# Altium project OvertheTOP.PrjPcb
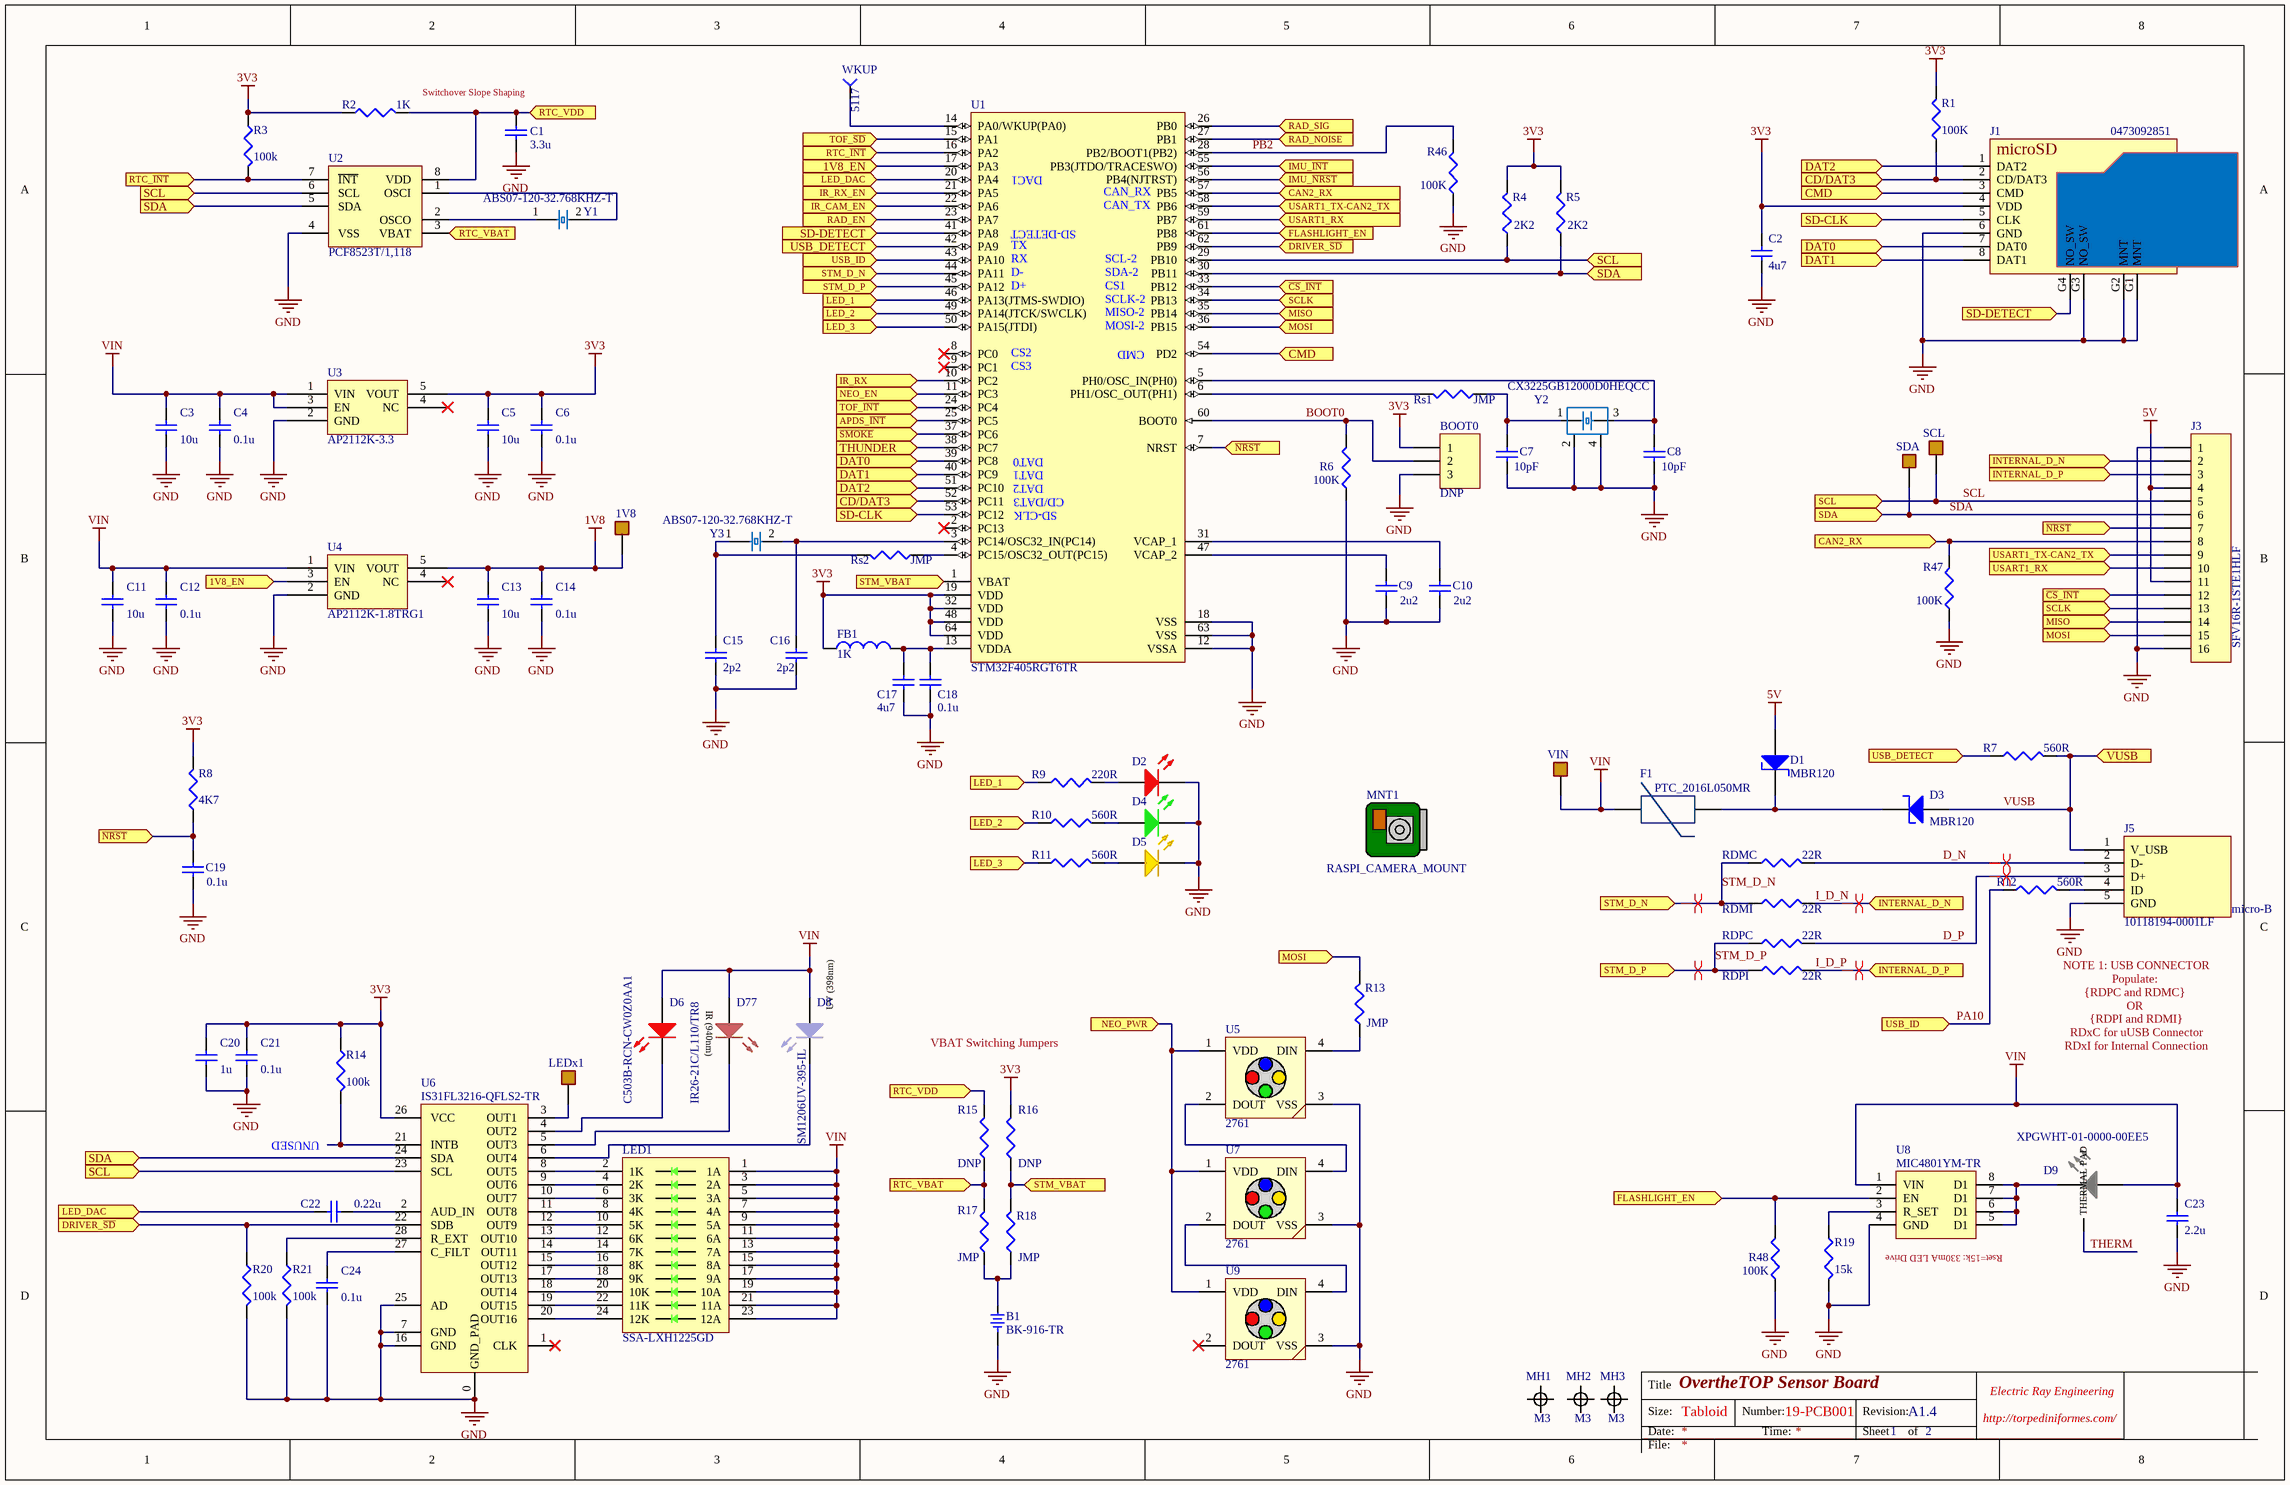
[diagram p0: OvertheTOP_Logistics.SchDoc]
1 sheet, 93 parts. Net scope: global (net labels, ports and power ports of the same name join across sheets).

## Sheet OvertheTOP_Logistics.SchDoc: OvertheTOP Sensor Board
size Tabloid; CompanyName: afasfe; Organization: Electric Ray Engineering; Address1: asdf; Address2: http://torpediniformes.com/; Address3: asdf; Address4: asdf; DocumentNumber: 19-PCB001; Revision: A1.4; SheetNumber: 1; SheetTotal: 2

### Parts
1V8  1.5mm  [TP_1.5mm_Square_Bare]  (value not drawn)
B1  BK-916-TR  [BK-916-TR]
BOOT0  value DNP  [HDR1X3]  (hidden comment: Header 3)
C1  value 3.3u  [6-0805_L]  (hidden comment: Cap)
C2  value 4u7  [1608[0603]]  (hidden comment: Cap Semi)
C3  value 10u  [6-0805_L]  (hidden comment: Cap)
C4  value 0.1u  [6-0805_L]  (hidden comment: Cap)
C5  value 10u  [6-0805_L]  (hidden comment: Cap)
C6  value 0.1u  [6-0805_L]  (hidden comment: Cap)
C7  value 10pF  [1608[0603]]  (hidden comment: Cap Semi)
C8  value 10pF  [1608[0603]]  (hidden comment: Cap Semi)
C9  value 2u2  [1608[0603]]  (hidden comment: Cap Semi)
C10  value 2u2  [1608[0603]]  (hidden comment: Cap Semi)
C11  value 10u  [6-0805_L]  (hidden comment: Cap)
C12  value 0.1u  [6-0805_L]  (hidden comment: Cap)
C13  value 10u  [6-0805_L]  (hidden comment: Cap)
C14  value 0.1u  [6-0805_L]  (hidden comment: Cap)
C15  value 2p2  [1608[0603]]  (hidden comment: Cap Semi)
C16  value 2p2  [1608[0603]]  (hidden comment: Cap Semi)
C17  value 4u7  [1608[0603]]  (hidden comment: Cap Semi)
C18  value 0.1u  [1608[0603]]  (hidden comment: Cap Semi)
C19  value 0.1u  [1608[0603]]  (hidden comment: Cap Semi)
C20  value 1u  [6-0805_L]  (hidden comment: Cap)
C21  value 0.1u  [6-0805_L]  (hidden comment: Cap)
C22  value 0.22u  [6-0805_L]  (hidden comment: Cap)
C23  value 2.2u  [6-0805_L]  (hidden comment: Cap)
C24  value 0.1u  [6-0805_L]  (hidden comment: Cap)
D1  Diode  [SOD-123FL]  (value not drawn)
D2  LED_RED_SMD  [IN-S63AT_RED]  (value not drawn)
D3  Diode  [SOD-123FL]  (value not drawn)
D4  LED_GREEN_0603  [IN-S63AT_GRN]  (value not drawn)
D5  LED_ORANGE_0603  [LO Q976]  (value not drawn)
D6  C503B-RCN-CW0Z0AA1  [C503B-RCN]
D8  SM1206UV-395-IL  [SM1206UV-395-IL]
D9  XPGWHT-01-0000-00EE5  [XP-G_LED]
D77  IR26-21C/L110/TR8  [IR26-21C/L110/TR8]
F1  PTC_2016L050MR  [PolyFuse_2016L]
FB1  value 1K  [J1-0603]  (hidden comment: Inductor)
J1  0473092851  [0473092851]
J3  SFV16R-1STE1HLF  [SFV16R-1STE1HLF]
J5  10118194-0001LF  [USB-R/A-10118194-0001LF]
LED1  SSA-LXH1225GD  [SSA-LXH1226GD]
LEDx1  1.5mm  [TP_1.5mm_Square_Bare]  (value not drawn)
MH1  M3  [M3_Loose]
MH2  M3  [M3_Loose]
MH3  M3  [M3_Loose]
MNT1  RASPI_CAMERA_MOUNT  [RPI-CAM-V2_1]
R1  value 100K  [J1-0603]  (hidden comment: Res3)
R2  value 1K  [J1-0603]  (hidden comment: Res3)
R3  value 100k  [J1-0603]  (hidden comment: Res3)
R4  value 2K2  [J1-0603]  (hidden comment: Res3)
R5  value 2K2  [J1-0603]  (hidden comment: Res3)
R6  value 100K  [J1-0603]  (hidden comment: Res3)
R7  value 560R  [J1-0603]  (hidden comment: Res3)
R8  value 4K7  [J1-0603]  (hidden comment: Res3)
R9  value 220R  [J1-0603]  (hidden comment: Res3)
R10  value 560R  [J1-0603]  (hidden comment: Res3)
R11  value 560R  [J1-0603]  (hidden comment: Res3)
R12  value 560R  [J1-0603]  (hidden comment: Res3)
R13  value JMP  [J1-0603]  (hidden comment: Res3)
R14  value 100k  [J1-0603]  (hidden comment: Res3)
R15  value DNP  [J1-0603]  (hidden comment: Res3)
R16  value DNP  [J1-0603]  (hidden comment: Res3)
R17  value JMP  [J1-0603]  (hidden comment: Res3)
R18  value JMP  [J1-0603]  (hidden comment: Res3)
R19  value 15k  [J1-0603]  (hidden comment: Res3)
R20  value 100k  [J1-0603]  (hidden comment: Res3)
R21  value 100k  [J1-0603]  (hidden comment: Res3)
R46  value 100K  [J1-0603]  (hidden comment: Res3)
R47  value 100K  [J1-0603]  (hidden comment: Res3)
R48  value 100K  [J1-0603]  (hidden comment: Res3)
RDMC  value 22R  [J1-0603]  (hidden comment: Res3)
RDMI  value 22R  [J1-0603]  (hidden comment: Res3)
RDPC  value 22R  [J1-0603]  (hidden comment: Res3)
RDPI  value 22R  [J1-0603]  (hidden comment: Res3)
Rs1  value JMP  [J1-0603]  (hidden comment: Res3)
Rs2  value JMP  [J1-0603]  (hidden comment: Res3)
SCL  1.5mm  [TP_1.5mm_Square_Bare]  (value not drawn)
SDA  1.5mm  [TP_1.5mm_Square_Bare]  (value not drawn)
U1  STM32F405RGT6TR  [STM-LQFP64_N]
U2  PCF8523T/1,118  [SO8_PCF8523]
U3  AP2112K-3.3  [SOT25]
U4  AP2112K-1.8TRG1  [SOT25]
U5  2761  [5050_SK6812]
U6  IS31FL3216-QFLS2-TR  [QFN28_ISSI]
U7  2761  [5050_SK6812]
U8  MIC4801YM-TR  [SOIC8_MIC4801]
U9  2761  [5050_SK6812]
VIN  1.5mm  [TP_1.5mm_Square_Bare]  (value not drawn)
WKUP  Manufacturer Part Number: 5117  [BLU_TP_KEYSTONE]  (hidden comment: BLU_TESTPOINT)
Y1  ABS07-120-32.768KHZ-T  [XTAL_32x15_BSB]
Y2  CX3225GB12000D0HEQCC  [XTAL32x25_BSB]
Y3  ABS07-120-32.768KHZ-T  [XTAL_32x15_BSB]

### Ports
1V8_EN, APDS_~{INT}, CAN2_RX, CD/DAT3, CMD, DAT0, DAT1, DAT2, DRIVER_~{SD}, FLASHLIGHT_EN, IMU_~{INT}, IMU_~{NRST}, INTERNAL_D_N, INTERNAL_D_P, IR_CAM_EN, IR_RX, IR_RX_EN, LED_1, LED_2, LED_3, LED_DAC, MISO, MOSI, NEO_EN, NEO_PWR, RAD_EN, RAD_NOISE, RAD_SIG, RTC_VBAT, RTC_VDD, RTC_~{INT}, SCL, SCLK, SD-CLK, SD-DETECT, SDA, STM_D_N, STM_D_P, STM_VBAT, THUNDER, TOF_~{INT}, TOF_~{SD}, USART1_RX, USART1_TX-CAN2_TX, USB_DETECT, USB_ID, VUSB, ~{CS}_~{INT}, ~{NRST}, ~{SMOKE}

### Nets
1V8: 1V8.1 C13.2 C14.2 U4.5(VOUT)
3V3: BOOT0.1 C2.2 C5.2 C6.2 C20.2 C21.2 FB1.1 J1.4(VDD) R1.2 R2.1 R3.1 R4.2 R5.2 R8.2 R14.1 R16.2 U1.19(VDD) U1.32(VDD) U1.48(VDD) U1.64(VDD) U3.5(VOUT) U6.26(VCC)
5V: D1.A J3.4 J3.11
GND: B1.2 BOOT0.3 C1.1 C2.1 C3.1 C4.1 C5.1 C6.1 C7.1 C8.1 C9.1 C10.1 C11.1 C12.1 C13.1 C14.1 C15.1 C16.1 C17.1 C18.1 C19.1 C20.1 C21.1 C23.1 C24.1 D2.K D4.K D5.K J1.6(GND) J1.G1(MNT) J1.G2(MNT) J1.G3(NO_SW) J3.1 J3.16 J5.5(GND) R6.1 R19.2 R20.2 R21.2 R46.1 R47.1 R48.1 U1.12(VSSA) U1.18(VSS) U1.63(VSS) U2.4(VSS) U3.2(GND) U4.2(GND) U5.3(VSS) U6.0(GND_PAD) U6.7(GND) U6.16(GND) U6.25(AD) U7.3(VSS) U8.4(GND) U9.3(VSS) Y2.2 Y2.4
VIN: C3.2 C4.2 C11.2 C12.2 C23.2 D6.1(A) D8.1(A) D9.1(A) D77.2 F1.2 LED1.1(1A) LED1.3(2A) LED1.5(3A) LED1.7(4A) LED1.9(5A) LED1.11(6A) LED1.13(7A) LED1.15(8A) LED1.17(9A) LED1.19(10A) LED1.21(11A) LED1.23(12A) U3.1(VIN) U3.3(EN) U4.1(VIN) U8.1(VIN) VIN.1
BOOT0: BOOT0.2 R6.2 U1.60(BOOT0)
D_N: J5.2(D-) RDMC.1
D_P: J5.3(D+) RDPC.1
I_D_N: J3.2 RDMI.1 ; port INTERNAL_D_N
I_D_P: J3.3 RDPI.1 ; port INTERNAL_D_P
PA10: R12.2 U1.43(PA10) ; port USB_ID
PB2: R46.2 U1.28(PB2/BOOT1(PB2))
SCL: J3.5 R4.1 SCL.1 U1.29(PB10) U2.6(SCL) U6.23(SCL) ; port SCL
SDA: J3.6 R5.1 SDA.1 U1.30(PB11) U2.5(SDA) U6.24(SDA) ; port SDA
STM_D_N: RDMC.2 RDMI.2 U1.44(PA11) ; port STM_D_N
STM_D_P: RDPC.2 RDPI.2 U1.45(PA12) ; port STM_D_P
THERM: D9.3(THERMAL_PAD)
VUSB: D3.A J5.1(V_USB) R7.1 ; port VUSB
NetB1_1: B1.1 R17.1 R18.1
NetC1_2: C1.2 R2.2 R15.2 U2.8(VDD) ; port RTC_VDD
NetC7_2: C7.2 Rs1.1 Y2.1
NetC8_2: C8.2 U1.5(PH0/OSC_IN(PH0)) Y2.3
NetC9_2: C9.2 U1.47(VCAP_2)
NetC10_2: C10.2 U1.31(VCAP_1)
NetC15_2: C15.2 Rs2.2 Y3.1
NetC16_2: C16.2 U1.3(PC14/OSC32_IN(PC14)) Y3.2
NetC17_2: C17.2 C18.2 FB1.2 U1.13(VDDA)
NetC19_2: C19.2 J3.7 R8.1 U1.7(NRST) ; port ~{NRST}
NetC22_1: C22.1 U1.20(PA4) ; port LED_DAC
NetC22_2: C22.2 U6.2(AUD_IN)
NetC24_2: C24.2 U6.27(C_FILT)
NetD1_K: D1.K D3.K F1.1
NetD2_A: D2.A R9.2
NetD4_A: D4.A R10.2
NetD5_A: D5.A R11.2
NetD6_2: D6.2(K) U6.4(OUT2)
NetD8_2: D8.2(K) U6.6(OUT4)
NetD9_2: D9.2(K) U8.5(D1) U8.6(D1) U8.7(D1) U8.8(D1)
NetD77_1: D77.1 U6.5(OUT3)
NetJ1_1: J1.1(DAT2) U1.51(PC10) ; port DAT2
NetJ1_2: J1.2(CD/DAT3) R1.1 U1.52(PC11) ; port CD/DAT3
NetJ1_3: J1.3(CMD) U1.54(PD2) ; port CMD
NetJ1_5: J1.5(CLK) U1.53(PC12) ; port SD-CLK
NetJ1_7: J1.7(DAT0) U1.39(PC8) ; port DAT0
NetJ1_8: J1.8(DAT1) U1.40(PC9) ; port DAT1
NetJ1_G4: J1.G4(NO_SW) U1.41(PA8) ; port SD-DETECT
NetJ3_8: J3.8 R47.2 U1.57(PB5) ; port CAN2_RX
NetJ3_9: J3.9 U1.58(PB6) ; port USART1_TX-CAN2_TX
NetJ3_10: J3.10 U1.59(PB7) ; port USART1_RX
NetJ3_12: J3.12 U1.33(PB12) ; port ~{CS}_~{INT}
NetJ3_13: J3.13 U1.34(PB13) ; port SCLK
NetJ3_14: J3.14 U1.35(PB14) ; port MISO
NetJ3_15: J3.15 R13.2 U1.36(PB15) ; port MOSI
NetJ5_4: J5.4(ID) R12.1
NetLED1_2: LED1.2(1K) U6.8(OUT5)
NetLED1_4: LED1.4(2K) U6.9(OUT6)
NetLED1_6: LED1.6(3K) U6.10(OUT7)
NetLED1_8: LED1.8(4K) U6.11(OUT8)
NetLED1_10: LED1.10(5K) U6.12(OUT9)
NetLED1_12: LED1.12(6K) U6.13(OUT10)
NetLED1_14: LED1.14(7K) U6.14(OUT11)
NetLED1_16: LED1.16(8K) U6.15(OUT12)
NetLED1_18: LED1.18(9K) U6.17(OUT13)
NetLED1_20: LED1.20(10K) U6.18(OUT14)
NetLED1_22: LED1.22(11K) U6.19(OUT15)
NetLED1_24: LED1.24(12K) U6.20(OUT16)
NetLEDx1_1: LEDx1.1 U6.3(OUT1)
NetR3_2: R3.2 U1.16(PA2) U2.7(~{INT}) ; port RTC_~{INT}
NetR7_2: R7.2 U1.42(PA9) ; port USB_DETECT
NetR9_1: R9.1 U1.46(PA13(JTMS-SWDIO)) ; port LED_1
NetR10_1: R10.1 U1.49(PA14(JTCK/SWCLK)) ; port LED_2
NetR11_1: R11.1 U1.50(PA15(JTDI)) ; port LED_3
NetR13_1: R13.1 U5.4(DIN)
NetR14_2: R14.2 U6.21(INTB)
NetR15_1: R15.1 R17.2 U2.3(VBAT) ; port RTC_VBAT
NetR16_1: R16.1 R18.2 U1.1(VBAT) ; port STM_VBAT
NetR19_1: R19.1 U8.3(R_SET)
NetR20_1: R20.1 U1.62(PB9) U6.22(SDB) ; port DRIVER_~{SD}
NetR21_1: R21.1 U6.28(R_EXT)
NetR48_2: R48.2 U1.61(PB8) U8.2(EN) ; port FLASHLIGHT_EN
NetRs1_2: Rs1.2 U1.6(PH1/OSC_OUT(PH1))
NetRs2_1: Rs2.1 U1.4(PC15/OSC32_OUT(PC15))
NetU1_10: U1.10(PC2) ; port IR_RX
NetU1_11: U1.11(PC3) ; port NEO_EN
NetU1_14: U1.14(PA0/WKUP(PA0)) WKUP.1
NetU1_15: U1.15(PA1) ; port TOF_~{SD}
NetU1_17: U1.17(PA3) U4.3(EN) ; port 1V8_EN
NetU1_21: U1.21(PA5) ; port IR_RX_EN
NetU1_22: U1.22(PA6) ; port IR_CAM_EN
NetU1_23: U1.23(PA7) ; port RAD_EN
NetU1_24: U1.24(PC4) ; port TOF_~{INT}
NetU1_25: U1.25(PC5) ; port APDS_~{INT}
NetU1_26: U1.26(PB0) ; port RAD_SIG
NetU1_27: U1.27(PB1) ; port RAD_NOISE
NetU1_37: U1.37(PC6) ; port ~{SMOKE}
NetU1_38: U1.38(PC7) ; port THUNDER
NetU1_55: U1.55(PB3(JTDO/TRACESWO)) ; port IMU_~{INT}
NetU1_56: U1.56(PB4(NJTRST)) ; port IMU_~{NRST}
NetU2_1: U2.1(OSCI) Y1.2
NetU2_2: U2.2(OSCO) Y1.1
NetU5_1: U5.1(VDD) U7.1(VDD) U9.1(VDD) ; port NEO_PWR
NetU5_2: U5.2(DOUT) U7.4(DIN)
NetU7_2: U7.2(DOUT) U9.4(DIN)

Not connected (* = marked no-connect by the designer): U1 2(PC13)* 8(PC0)* 9(PC1)*; U3 4(NC)*; U4 4(NC)*; U6 1(CLK)*; U9 2(DOUT)*

### Layout directives
differential pair: D_N, D_P, I_D_N, I_D_P, STM_D_N, STM_D_P

### Notes on the sheet
- Switchover Slope Shaping
- (near U1) DAC1
- (near U1) SD-DETECT
- (near U1) CAN_TX
- (near U1) CAN_RX
- (near U1) D+
- (near U1) D-
- (near U1) RX
- (near U1) TX
- (near U1) SCL-2
- (near U1) SDA-2
- (near U1) CS1
- (near U1) SCLK-2
- (near U1) CS2
- (near U1) MISO-2
- (near U1) MOSI-2
- (near U1) CMD
- (near U1) CS3
- (near U1) DAT2
- (near U1) DAT0
- (near U1) DAT1
- (near U1) CD/DAT3
- (near U1) SD-CLK
- VBAT Switching Jumpers
- NOTE 1: USB CONNECTOR
  Populate:
  {RDPC and RDMC}
  OR
  {RDPI and RDMI}
  RDxC for uUSB Connector
  RDxI for Internal Connection
- UNUSED
- (near U8) Rset=15k: 330mA LED Drive
- Title
- Size:
- Date:
- Tabloid
- Number:
- Time:
- Revision:
- Sheet
- of
- File:
- (in symbol 10118194-0001LF) micro-B
- (in symbol 473092851) microSD
- (in symbol IR26-21C/L110/TR8) IR (940nm)
- (in symbol SM1206UV-395-IL) UV (398nm)

### Library data of the parts
1V8 LEDx1 SCL SDA VIN = TestPoint_Solderable_1.5mm_Bare: Testpoint Solderable 1.5mm Square
B1 = BK-916-TR: BATTERY RETAINER COIN 12MM SMD; Manufacturer: MPD (Memory Protection Devices); Manufacturer Part Number: BK-916-TR
BOOT0 = Header 3: Header, 3-Pin; LatestRevisionDate: 17-Jul-2002; LatestRevisionNote: Re-released for DXP Platform.; Publisher: Altium Limited
C1 C3-C6 C11-C14 C20-C24 = Cap: Capacitor; Published: 8-Jun-2000; LatestRevisionDate: 17-Jul-2002; LatestRevisionNote: Re-released for DXP Platform.; PackageReference: RAD-0.3; Publisher: Altium Limited; PackageDescription: Radial Cap, Thru-Hole; 2 Leads; 0.3 in Pin Spacing
C2 C7-C10 C15-C19 = Cap Semi: Capacitor (Semiconductor SIM Model); Published: 8-Jun-2000; LatestRevisionDate: 29-May-2009; LatestRevisionNote: IPC-7351 Footprint Added.; PackageReference: C1206; Publisher: Altium Limited; PackageDescription: Chip Capacitor; Supplier 1: Digi-Key
  C2 C17: Supplier Part Number 1: 490-14638-1-ND
  C7 C8: Supplier Part Number 1: 490-3570-1-ND
  C9 C10: Supplier Part Number 1: 445-13221-1-ND
  C15 C16: Supplier Part Number 1: 490-11271-1-ND
  C18 C19: Supplier Part Number 1: 490-4774-1-ND
D1 D3 = MBR120: DIODE SCHOTTKY 20V 1A SOD123FL; Manufacturer: ON Semiconductor; Manufacturer Part Number: MBR120; Supplier 1: Digi-Key; Supplier Part Number 1: MBR120VLSFT3GOSCT-ND
D2 = LED_RED_SMD: Generic LED, SMD, RED; Supplier 1: Digi-Key; Supplier Part Number 1: 1830-1065-1-ND
D4 = LED_GREEN_0603: Generic LED, 0603, GREEN; Supplier 1: Digi-Key; Supplier Part Number 1: 1830-1062-1-ND
D5 = LED_ORANGE_0603: Generic LED, 0603, ORANGE; Supplier 1: Digi-Key; Supplier Part Number 1: 475-2486-1-ND
D6 = C503B-RCN-CW0Z0AA1: LED RED CLEAR 5MM ROUND T/H; Manufacturer: Cree Inc.; Manufacturer Part Number: C503B-RCN-CW0Z0AA1
D8 = SM1206UV-395-IL: EMITTER UV 398NM 25MA 1206; Manufacturer: Bivar Inc.; Manufacturer Part Number: SM1206UV-395-IL
D9 = CREE_wLENS_XP-G_1: LED XLAMP NEUTRAL WHT 4000K 2SMD; Manufacturer: Cree Inc.; Manufacturer Part Number: XPGWHT-01-0000-00EE5
D77 = IR26-21C/L110/TR8: EMITTER IR 940NM 65MA 1206; Manufacturer: Everlight Electronics Co Ltd; Manufacturer Part Number: IR26-21C/L110/TR8
F1 = PTC_2016L050MR_LITTELFUSE: 600mA PTC; Manufacturer: Littelfuse Inc.; Manufacturer Part Number: 2016L050MR; Supplier 1: Digi-Key; Supplier Part Number 1: F4070CT-ND
FB1 = Inductor: Code_IEC: 1005; Published: 8-Jun-2000; LatestRevisionDate: 29-May-2009; LatestRevisionNote: IPC-7351 Footprint Added.; PackageReference: 0402-A; Publisher: Altium Limited; PackageDescription: Chip Inductor; Code_JEITA: 0402; Supplier 1: Digi-Key; Supplier Part Number 1: 490-1015-1-ND
J1 = 473092851: CONN MICRO SD CARD PUSH-PULL R/A; Manufacturer: Molex, LLC; Manufacturer Part Number: 0473092851; Supplier 1: Digi-Key; Supplier Part Number 1: WM6701CT-ND
J3 = SFV16R-1STE1HLF: CONN FFC BOTTOM 16POS 0.50MM R/A; Manufacturer: Amphenol ICC (FCI); Manufacturer Part Number: SFV16R-1STE1HLF
J5 = 10118194-0001LF: USB uB R/A Board Edge Connector; Manufacturer: Amphenol FCI; Manufacturer Part Number: 10118194-0001LF; Supplier 1: Digi-Key; Supplier Part Number 1: 609-4618-1-ND
LED1 = SSA-LXH1225GD: LED ARRAY 2.5X5MM 12-SEG GREEN; Manufacturer: Lumex Opto/Components Inc.; Manufacturer Part Number: SSA-LXH1225GD
MH1-MH3 = M3_Loose_Mount: A Loose Fitting M3 Mounting Hole
MNT1 = RASPI_CAMERA_MOUNT: Mounting Hole for RASPI Camera 2.1; Manufacturer: Raspberry Pi; Manufacturer Part Number: RPI-CAM-V2_1
R1-R21 R46-R48 RDMC RDMI RDPC RDPI Rs1 Rs2 = Res3: Resistor; Published: 8-Jun-2000; LatestRevisionDate: 29-May-2009; LatestRevisionNote: IPC-7351 Footprint Added.; PackageReference: J1-0603; Publisher: Altium Limited; PackageDescription: Chip Resistor
  R1 R6 R46-R48 Rs1 Rs2: Supplier 1: Digi-Key; Supplier Part Number 1: 311-100KLDCT-ND
  R4 R5 R8 R13: Supplier 1: Digi-Key; Supplier Part Number 1: 311-4.70KHRCT-ND
  R7 R10-R12: Supplier 1: Digi-Key; Supplier Part Number 1: 311-560GRCT-ND
  R9: Supplier 1: Digi-Key; Supplier Part Number 1: 311-220HRCT-ND
  RDMC RDMI RDPC RDPI: Supplier 1: Digi-Key; Supplier Part Number 1: 311-22GRCT-ND
U1 = CMP-0243-00156-1: ARM Cortex-M4 32-bit MCU+FPU, 1024 KB Flash, 192 KB Internal RAM, 51 I/Os, 64-Pin LQFP, -40 to 85 degC, Tape and Reel; Internal RAM Size (kB): 192; FLASH Size (Prog) (kB): 1024; Supply Voltage(Vcc) min (V): 1.8; D/A Converter: 2; Operating Frequency(F) (Processor speed) (MHz): 168; I/Os (High Current): 51; DatasheetVersion: Rev. 6; Package Description: LQFP64; ComponentLink2Description: Datasheet; ComponentLink1Description: Manufacturer URL; Packing: Tape and Reel; Mounting Technology: Surface Mount; Package Reference: 64-Pin Low-profile Quad Flat Package, Body 10 x 10 mm, Pitch 0.5 mm; ComponentLink2URL: http://www.st.com/st-web-ui/static/active/en/resource/technical/document/datasheet/DM00037051.pdf; ComponentLink1URL: http://www.st.com/; Core: ARM Cortex-M4; Supplier 1: Digi-Key; Supplier Part Number 1: 497-17432-1-ND
U2 = PCF8523: IC RTC CLK/CALENDAR I2C 8-SOIC; Manufacturer: NXP USA Inc.; Manufacturer Part Number: PCF8523T/1,118
U3 = AP2112K-3.3: IC REG LINEAR 3.3V 600MA SOT25; Manufacturer: Diodes Incorporated; Manufacturer Part Number: AP2112K-3.3
U4 = AP2112K-1.8TRG1: IC REG LINEAR 1.8V 600MA SOT25; Manufacturer: Diodes Incorporated; Manufacturer Part Number: AP2112K-1.8TRG1
U5 U7 U9 = SK6812RGBW-Natural: ADDRESS LED DISCR SER RGBW NATURAL; Manufacturer: Adafruit Industries LLC; Manufacturer Part Number: 2761
U6 = IS31FL3216: IC LED DRIVER LIN DIM 20MA 28QFN; Manufacturer: ISSI, Integrated Silicon Solution Inc; Manufacturer Part Number: IS31FL3216-QFLS2-TR
U8 = MIC4801: IC LED DRVR LIN DIM 600MA 8SOIC; Manufacturer: Microchip Technology; Manufacturer Part Number: MIC4801YM-TR
WKUP = BLU_TESTPOINT: 5117K - BLU KEYSTONE TESTPOINT; Manufacturer: Keystone
Y1 Y3 = ABS07-120-32.768KHZ-T: CRYSTAL 32.7680KHZ 6PF SMD; Manufacturer: Abracon LLC; Manufacturer Part Number: ABS07-120-32.768KHZ-T
  Y3: Supplier 1: Digi-Key; Supplier Part Number 1: 535-11937-1-ND
Y2 = CX3225GB12000D0HEQCC: CRYSTAL 12.0000MHZ 8PF SMD; Manufacturer: AVX / Kyocera; Manufacturer Part Number: CX3225GB12000D0HEQCC; Supplier 1: Digi-Key; Supplier Part Number 1: 1253-1166-1-ND